# Altium schematic sheet MAIN.SchDoc: Printer
size 431 x 279 mm; Date: 2022; Author: Renaissance; CompanyName: Upenn-ESE516; DrawnBy: Xinyang Tan;  Yuxin Wang; Engineer: Xinyang Tan;  Yuxin Wang; Address1: 200 S 33 St; Address2: Moore Building, Rm 101; Address3: Philadephla, PA 19104; DocumentNumber: 1; Revision: 1.0; SheetNumber: 1; SheetTotal: 9; Project: Printer.PrjPcb; ENG_APP_DATE: --/--/--; DSN_APP_DATE: --/--/--; CHK_APP_DATE: --/--/--; Time: 03/02
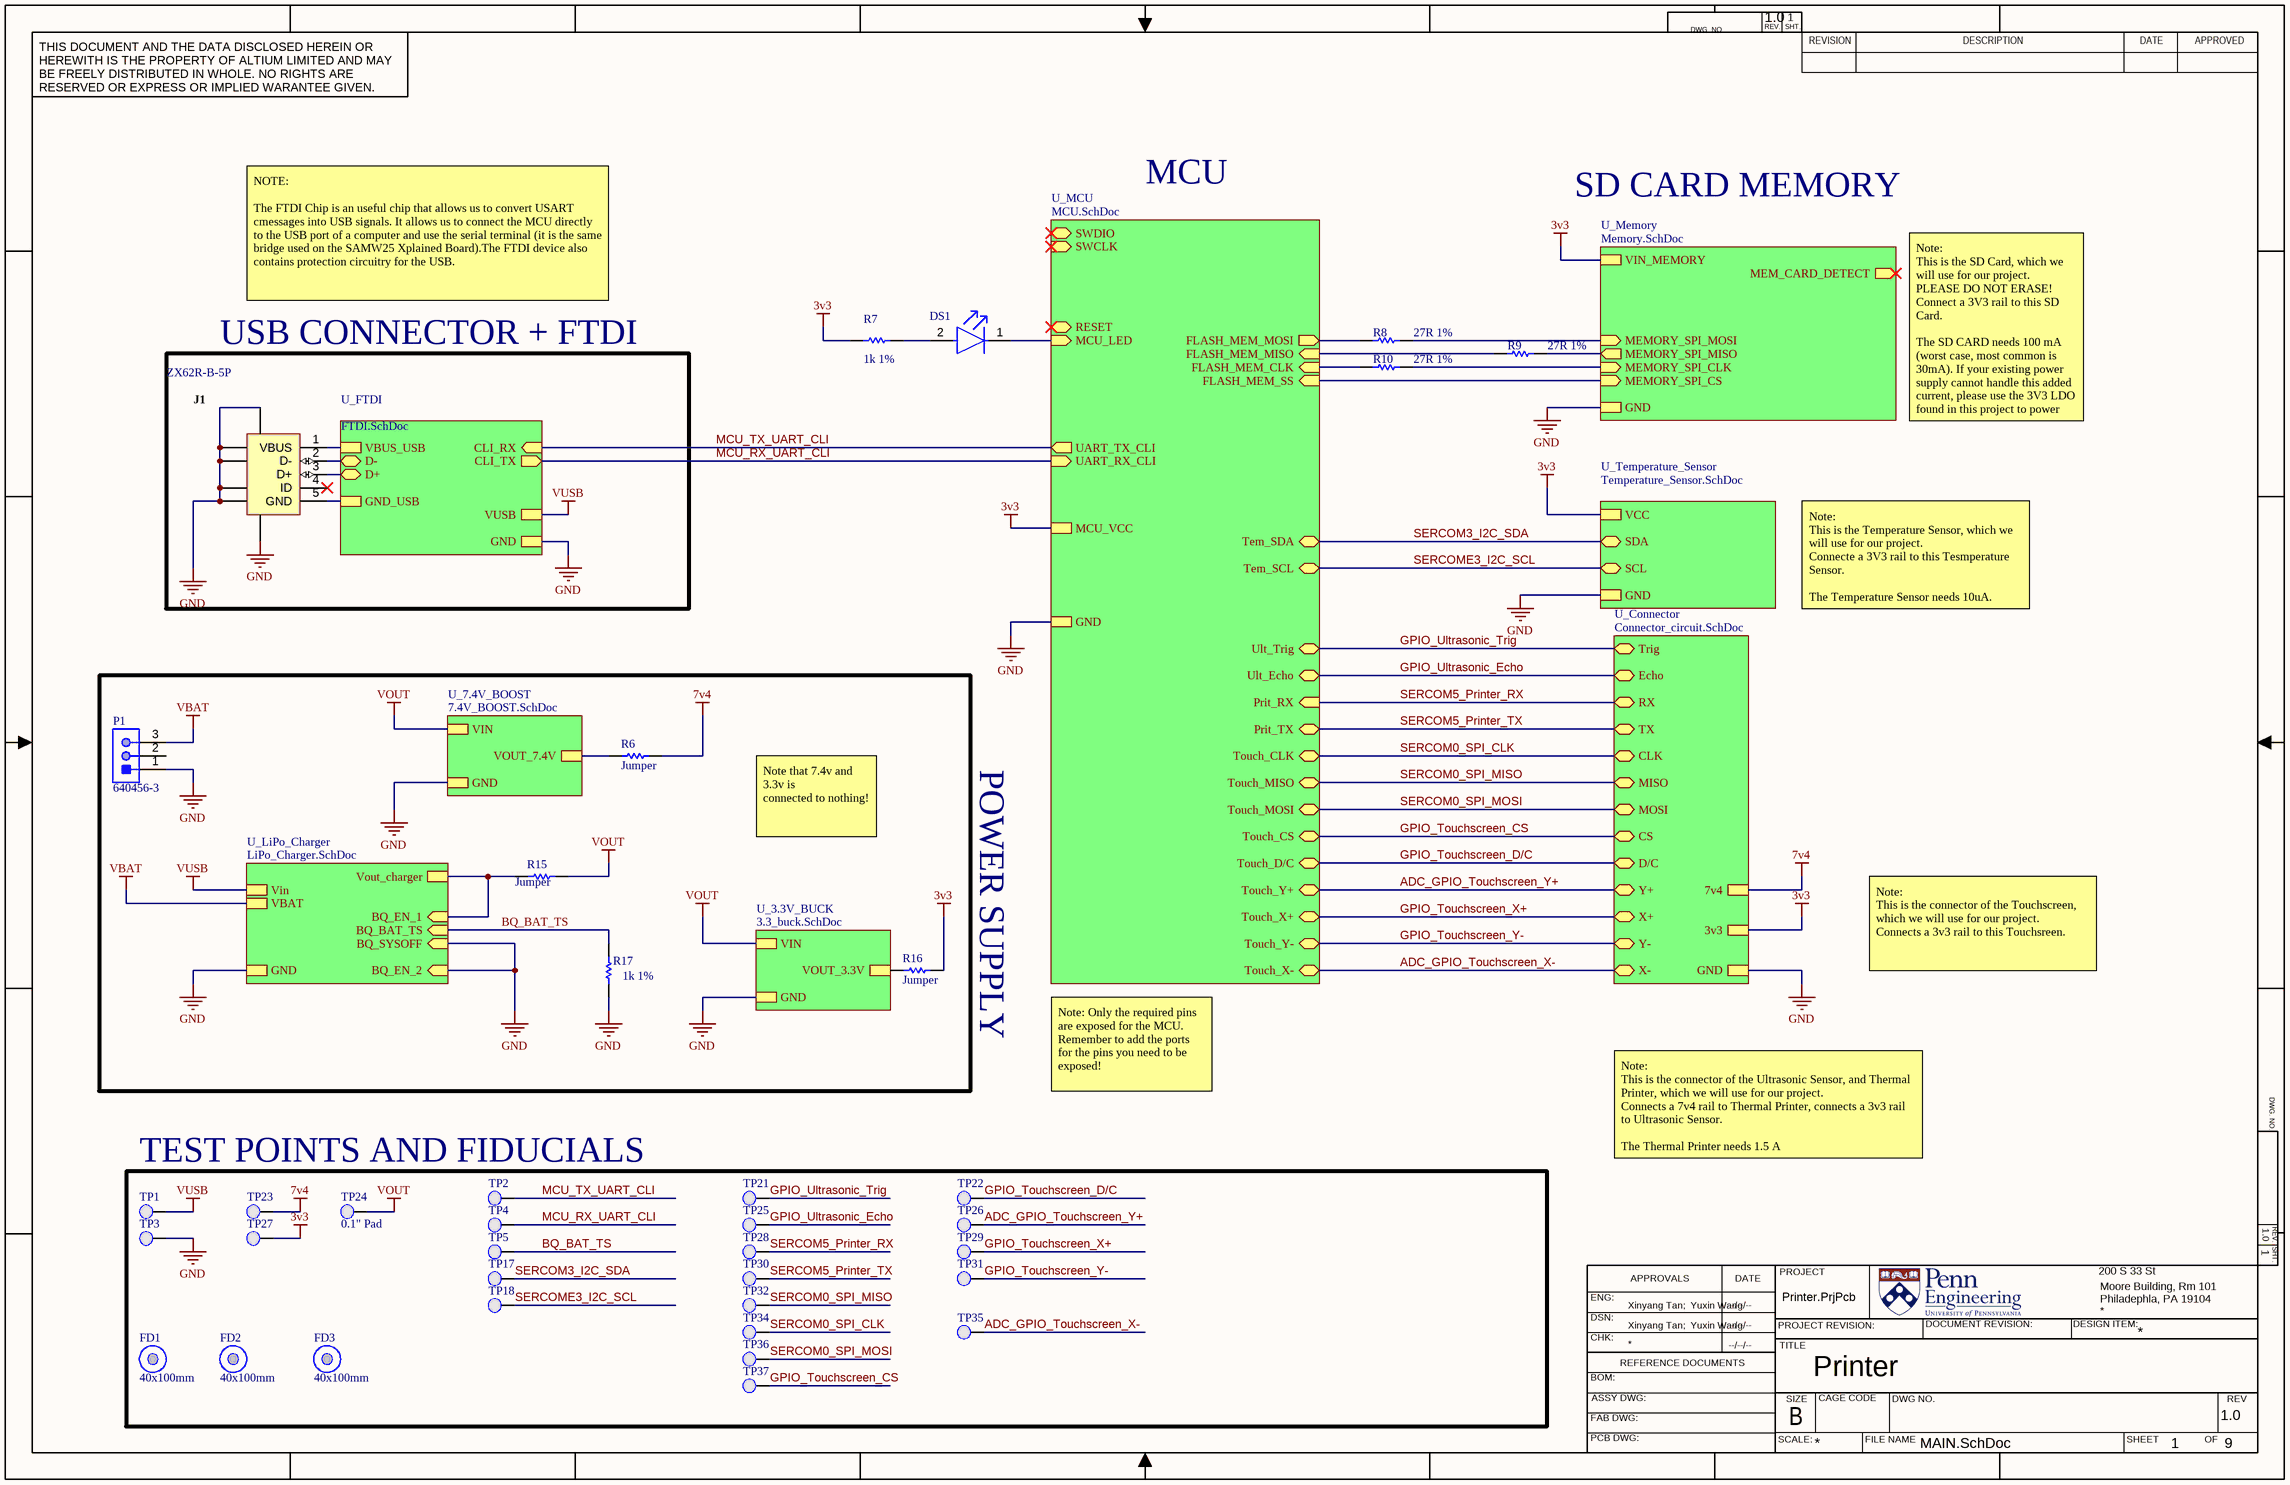
[diagram p0: MAIN.SchDoc]

## Parts
DS1  LTST-C191KGKT  [FP-LTST-C191KGKT-MFG]  (value not drawn)
FD1  40x100mm  [Fiducial_FT]  (no BOM)
FD2  40x100mm  [Fiducial_FT]  (no BOM)
FD3  40x100mm  [Fiducial_FT]  (no BOM)
J1  ZX62R-B-5P  [HIRO-ZX62R-B-5P_V]
P1  640456-3  [TECO-640456-3]
R6  Jumper  [RESC1609X50X30LL10T20]
R7  1k 1%  [RESC1609X50X30NL10T20]
R8  27R 1%  [RESC0603(1608)_N]
R9  27R 1%  [RESC0603(1608)_N]
R10  27R 1%  [RESC0603(1608)_N]
R15  Jumper  [RESC1609X50X30LL10T20]
R16  Jumper  [RESC1609X50X30LL10T20]
R17  1k 1%  [RESC0603(1608)_N]
TP1  0.1" Pad  [PCBComponent]  (value not drawn)
TP2  0.1" Pad  [PCBComponent]  (value not drawn)
TP3  0.1" Pad  [PCBComponent]  (value not drawn)
TP4  0.1" Pad  [PCBComponent]  (value not drawn)
TP5  0.1" Pad  [PCBComponent]  (value not drawn)
TP17  0.1" Pad  [PCBComponent]  (value not drawn)
TP18  0.1" Pad  [PCBComponent]  (value not drawn)
TP21  0.1" Pad  [PCBComponent]  (value not drawn)
TP22  0.1" Pad  [PCBComponent]  (value not drawn)
TP23  0.1" Pad  [PCBComponent]  (value not drawn)
TP24  0.1" Pad  [PCBComponent]
TP25  0.1" Pad  [PCBComponent]  (value not drawn)
TP26  0.1" Pad  [PCBComponent]  (value not drawn)
TP27  0.1" Pad  [PCBComponent]  (value not drawn)
TP28  0.1" Pad  [PCBComponent]  (value not drawn)
TP29  0.1" Pad  [PCBComponent]  (value not drawn)
TP30  0.1" Pad  [PCBComponent]  (value not drawn)
TP31  0.1" Pad  [PCBComponent]  (value not drawn)
TP32  0.1" Pad  [PCBComponent]  (value not drawn)
TP34  0.1" Pad  [PCBComponent]  (value not drawn)
TP35  0.1" Pad  [PCBComponent]  (value not drawn)
TP36  0.1" Pad  [PCBComponent]  (value not drawn)
TP37  0.1" Pad  [PCBComponent]  (value not drawn)

## Blocks framed on the sheet
USB CONNECTOR + FTDI: J1
TEST POINTS AND FIDUCIALS: FD1-FD3 TP1-TP5 TP17 TP18 TP21-TP32 TP34-TP37

## Sub-sheets
U_3.3V_BUCK = 3.3_buck.SchDoc: VIN, GND, VOUT_3.3V
U_7.4V_BOOST = 7.4V_BOOST.SchDoc: VIN, GND, VOUT_7.4V
U_Connector = Connector_circuit.SchDoc: CLK (bidir), MISO (bidir), MOSI (bidir), CS (bidir), D/C (bidir), Y+ (bidir), X+ (bidir), Y- (bidir), X- (bidir), 7v4, 3v3, GND, Trig (bidir), Echo (bidir), RX (bidir), TX (bidir)
U_FTDI = FTDI.SchDoc: CLI_RX (in), CLI_TX (out), VUSB, GND, VBUS_USB, D- (bidir), D+ (bidir), GND_USB
U_LiPo_Charger = LiPo_Charger.SchDoc: Vin, VBAT, GND, Vout_charger, BQ_EN_1 (in), BQ_BAT_TS (in), BQ_SYSOFF (in), BQ_EN_2 (in)
U_MCU = MCU.SchDoc: SWDIO (bidir), SWCLK (in), UART_TX_CLI (out), UART_RX_CLI (in), FLASH_MEM_SS (in), FLASH_MEM_CLK (in), FLASH_MEM_MISO (in), FLASH_MEM_MOSI (out), RESET (bidir), MCU_LED (in), MCU_VCC, GND, Tem_SDA (bidir), Tem_SCL (bidir), Ult_Trig (bidir), Ult_Echo (bidir), Prit_RX (in), Prit_TX (bidir), Touch_CLK (bidir), Touch_MISO (bidir), Touch_MOSI (bidir), Touch_CS (bidir), Touch_D/C (bidir), Touch_Y+ (bidir), Touch_X+ (bidir), Touch_Y- (bidir), Touch_X- (bidir)
U_Memory = Memory.SchDoc: MEMORY_SPI_MOSI (in), MEMORY_SPI_MISO (out), MEMORY_SPI_CLK (in), MEMORY_SPI_CS (in), MEM_CARD_DETECT (out), VIN_MEMORY, GND
U_Temperature_Sensor = Temperature_Sensor.SchDoc: VCC, SDA (bidir), SCL (bidir), GND

## Nets
3v3: R7.1 R16.2 TP27.1(PAD) ; sheet U_MCU/MCU_VCC, sheet U_Memory/VIN_MEMORY, sheet U_Temperature_Sensor/VCC, sheet U_Connector/3v3
7v4: R6.2 TP23.1(PAD) ; sheet U_Connector/7v4
GND: J1.6(SHLD) J1.7(SHLD) J1.8(SHLD) J1.9(SHLD) J1.10(SHLD) J1.11(SHLD) P1.1 R17.1 TP3.1(PAD) ; sheet U_FTDI/GND, sheet U_MCU/GND, sheet U_Memory/GND, sheet U_Temperature_Sensor/GND, sheet U_Connector/GND, sheet U_LiPo_Charger/GND, sheet U_LiPo_Charger/BQ_SYSOFF, sheet U_LiPo_Charger/BQ_EN_2, sheet U_7.4V_BOOST/GND, sheet U_3.3V_BUCK/GND
VBAT: P1.3 ; sheet U_LiPo_Charger/VBAT
VOUT: R15.2 TP24.1(PAD) ; sheet U_7.4V_BOOST/VIN, sheet U_3.3V_BUCK/VIN
VUSB: TP1.1(PAD) ; sheet U_FTDI/VUSB, sheet U_LiPo_Charger/Vin
ADC_GPIO_Touchscreen_X-: TP35.1(PAD) ; sheet U_MCU/Touch_X-, sheet U_Connector/X-
ADC_GPIO_Touchscreen_Y+: TP26.1(PAD) ; sheet U_MCU/Touch_Y+, sheet U_Connector/Y+
BQ_BAT_TS: R17.2 TP5.1(PAD) ; sheet U_LiPo_Charger/BQ_BAT_TS
GPIO_Touchscreen_CS: TP37.1(PAD) ; sheet U_MCU/Touch_CS, sheet U_Connector/CS
GPIO_Touchscreen_D/C: TP22.1(PAD) ; sheet U_MCU/Touch_D/C, sheet U_Connector/D/C
GPIO_Touchscreen_X+: TP29.1(PAD) ; sheet U_MCU/Touch_X+, sheet U_Connector/X+
GPIO_Touchscreen_Y-: TP31.1(PAD) ; sheet U_MCU/Touch_Y-, sheet U_Connector/Y-
GPIO_Ultrasonic_Echo: TP25.1(PAD) ; sheet U_MCU/Ult_Echo, sheet U_Connector/Echo
GPIO_Ultrasonic_Trig: TP21.1(PAD) ; sheet U_MCU/Ult_Trig, sheet U_Connector/Trig
MCU_RX_UART_CLI: TP4.1(PAD) ; sheet U_FTDI/CLI_TX, sheet U_MCU/UART_RX_CLI
MCU_TX_UART_CLI: TP2.1(PAD) ; sheet U_FTDI/CLI_RX, sheet U_MCU/UART_TX_CLI
SERCOM0_SPI_CLK: TP34.1(PAD) ; sheet U_MCU/Touch_CLK, sheet U_Connector/CLK
SERCOM0_SPI_MISO: TP32.1(PAD) ; sheet U_MCU/Touch_MISO, sheet U_Connector/MISO
SERCOM0_SPI_MOSI: TP36.1(PAD) ; sheet U_MCU/Touch_MOSI, sheet U_Connector/MOSI
SERCOM3_I2C_SDA: TP17.1(PAD) ; sheet U_MCU/Tem_SDA, sheet U_Temperature_Sensor/SDA
SERCOM5_Printer_RX: TP28.1(PAD) ; sheet U_MCU/Prit_RX, sheet U_Connector/RX
SERCOM5_Printer_TX: TP30.1(PAD) ; sheet U_MCU/Prit_TX, sheet U_Connector/TX
SERCOME3_I2C_SCL: TP18.1(PAD) ; sheet U_MCU/Tem_SCL, sheet U_Temperature_Sensor/SCL
NetDS1_1: DS1.1(C) ; sheet U_MCU/MCU_LED
NetDS1_2: DS1.2(A) R7.2
NetJ1_1: J1.1(VBUS) ; sheet U_FTDI/VBUS_USB
NetJ1_2: J1.2(D-) ; sheet U_FTDI/D-
NetJ1_3: J1.3(D+) ; sheet U_FTDI/D+
NetJ1_5: J1.5(GND) ; sheet U_FTDI/GND_USB
NetR6_1: R6.1 ; sheet U_7.4V_BOOST/VOUT_7.4V
NetR8_1: R8.1 ; sheet U_MCU/FLASH_MEM_MOSI
NetR8_2: R8.2 ; sheet U_Memory/MEMORY_SPI_MOSI
NetR9_1: R9.1 ; sheet U_MCU/FLASH_MEM_MISO
NetR9_2: R9.2 ; sheet U_Memory/MEMORY_SPI_MISO
NetR10_1: R10.1 ; sheet U_MCU/FLASH_MEM_CLK
NetR10_2: R10.2 ; sheet U_Memory/MEMORY_SPI_CLK
NetR15_1: R15.1 ; sheet U_LiPo_Charger/Vout_charger, sheet U_LiPo_Charger/BQ_EN_1
NetR16_1: R16.1 ; sheet U_3.3V_BUCK/VOUT_3.3V
(unnamed): sheet U_MCU/FLASH_MEM_SS, sheet U_Memory/MEMORY_SPI_CS

Not connected (* = marked no-connect by the designer): J1 4(ID)*; P1 2

## Notes on the sheet
- MCU
- SD CARD MEMORY
- NOTE:
  The FTDI Chip is an useful chip that allows us to convert USART cmessages into USB signals. It allows us to connect the MCU directly to the USB port of a computer and use the serial terminal (it is the same bridge used on the SAMW25 Xplained Board).The FTDI device also contains protection circuitry for the USB.
- Note:
  This is the SD Card, which we will use for our project. PLEASE DO NOT ERASE! Connect a 3V3 rail to this SD Card.
  The SD CARD needs 100 mA (worst case, most common is 30mA). If your existing power supply cannot handle this added current, please use the 3V3 LDO found in this project to power your SD Card.
- Note:
  This is the Temperature Sensor, which we will use for our project.
  Connecte a 3V3 rail to this Tesmperature Sensor.
  The Temperature Sensor needs 10uA.
- (near R16) POWER SUPPLY
- Note that 7.4v and 3.3v is
  connected to nothing!
- Note:
  This is the connector of the Touchscreen, which we will use for our project.
  Connects a 3v3 rail to this Touchsreen.
- Note: Only the required pins are exposed for the MCU. Remember to add the ports for the pins you need to be exposed!
- Note:
  This is the connector of the Ultrasonic Sensor, and Thermal Printer, which we will use for our project.
  Connects a 7v4 rail to Thermal Printer, connects a 3v3 rail to Ultrasonic Sensor.
  The Thermal Printer needs 1.5 A
- DWG. NO.
- REV.
- SHT.
- THIS DOCUMENT AND THE DATA DISCLOSED HEREIN OR HEREWITH IS THE PROPERTY OF ALTIUM LIMITED AND MAY BE FREELY DISTRIBUTED IN WHOLE. NO RIGHTS ARE RESERVED OR EXPRESS OR IMPLIED WARANTEE GIVEN.
- REVISION
- DESCRIPTION
- DATE
- APPROVED
- ENG:
- APPROVALS
- PROJECT
- DSN:
- CHK:
- REFERENCE DOCUMENTS
- PROJECT REVISION:
- TITLE
- DOCUMENT REVISION:
- DESIGN ITEM:
- BOM:
- FAB DWG:
- PCB DWG:
- ASSY DWG:
- SCALE:
- SIZE
- B
- CAGE CODE
- FILE NAME
- DWG NO.
- SHEET
- OF
- REV

## Library data of the parts
DS1 = CMP-2000-05198-2: LED GREEN CLEAR SMD; Forward Voltage: 2V; Number of Elements: 1; Viewing Angle: 130°; Forward Current: 30mA; Luminous Intensity: 35mcd; Reverse Voltage: 5V; Power Dissipation: 75mW; Lens Color: Colorless; Dominant Wavelength: 571nm; Lens Style: Rectangular; Test Current: 20mA; Wavelength: 574nm; Packaging: Tape and Reel; Width: 0.8mm; Case Code (Imperial): 0603; Number of Pins: 2; Max Power Dissipation: 75mW; Lead Free: Lead Free; Package Quantity: 1; Min Operating Temperature: -55°C; Case/Package: 0603; Length: 1.6mm; Depth: 0.8mm; Radiation Hardening: No; Mount: Surface Mount; Max Operating Temperature: 85°C; Color: Green; Power Rating: 75mW; Height: 0.55mm; Number of LEDs: 1; Illumination Color: Green; Case Code (Metric): 1608; Lens Transparency: Clear
FD1-FD3 = CMP-00174-A.4: Fiducial 40x100mm
J1 = CMP-0031-00001-1: Connector; USBMicro-B,Reverse type, SMT; 5 Position; Right Angle; DatasheetVersion: 08/2010; Operating Temperature: -30 to 85 degC; Mounting Technology: Surface Mount; PartNumber: ZX62R-B-5P; PackageReference: ZX62R-B-5P; ComponentLink2URL: http://www.hirose.co.jp/cataloge_hp/e24200011.pdf; ComponentLink1URL: http://www.hirose.com/â€Ž; ComponentLink2Description: Datasheet; PackageDescription: 5-Pin USB Micro-B R/A Connector; ComponentLink1Description: Manufacturer URL
P1 = CMP-2000-05418-1: Male Header, Pitch 2.54 mm, 1 x 3 Position, Height 10.03 mm, Tail Length 3.56 mm, -55 to 105 degC; Manufacturer: TE Connectivity; Agency Approvals: CSA,UL; Angle: Straight; Number of Positions: 3; Standards: RoHSCompliant,ELVCompliant,UL94V-0; Current, Rating: 5 / A; Connector Type: MTA-100; Mount Angle: Vertical; Material, Housing: Polyester; Temperature, Operating: -55to+105 / degC; Voltage, Rating: 250 / V; Color, Housing: White; Contact Centerline Spacing: 0.100 / in.; Special Features: Pinstrip; Material, Contact: CopperAlloy; Contact Termination Area Plating: Tin; Primary Type: InterconnectSystem; Pin Spacing: 0.1 / "; Brand/Series: MTA-100Series; Mounting Hole Size: 0.04 / "; Manufacturer URL: http://www.te.com/; Datasheet URL: https://datasheet.ciiva.com/16456/eng-ds-82056-mta-0608-16456886.pdf; Flammability Rating: UL94V-0; Mounting Type: PCMount; Contact Mating Area Plating: Tin; Datasheet Version: Jun-08; Number of Rows: 1; Termination: Solder; Type: PCBPlug; Length, Pin: 0.14 / "; Color: White; Contact Plating: Tin; Contact Shape: Square; Number of Contacts: 3; Size, Post: 0.025 / in.; Length, Terminal Post: 0.14 / in.; Length, Overall: 0.3 / "
R6 R15 R16 = CMP-1012-00001-2: Manufacturer: Vishay Dale; Part Number: CRCW06030000Z0EC
R7 = CMP-1012-00510-2: Manufacturer: Vishay Dale; Part Number: CRCW06031K00FKEB
R8-R10 = CMP-1012-00331-1: 27R 0.1W 1% 0603 (1608 Metric)  SMD; Case-EIA: 0603; Value: 27.00 Ohm; Case-Metric: 1608; Technology: SMT; Tolerance: 1 %; Power: 0.1 W
R17 = CMP-1012-00001-1: Jumper 0603 (1608 Metric); Case-Metric: 1608; Value: 0.00 Ohm; Power: None; Case-EIA: 0603; Technology: SMT; Tolerance: None
TP1-TP5 TP17 TP18 TP21-TP32 TP34-TP37 = 0.1" Pad-A.4